# EAGLE board rc_filter_v1-xld50 (EAGLE 9.3.0), part 1 of 2
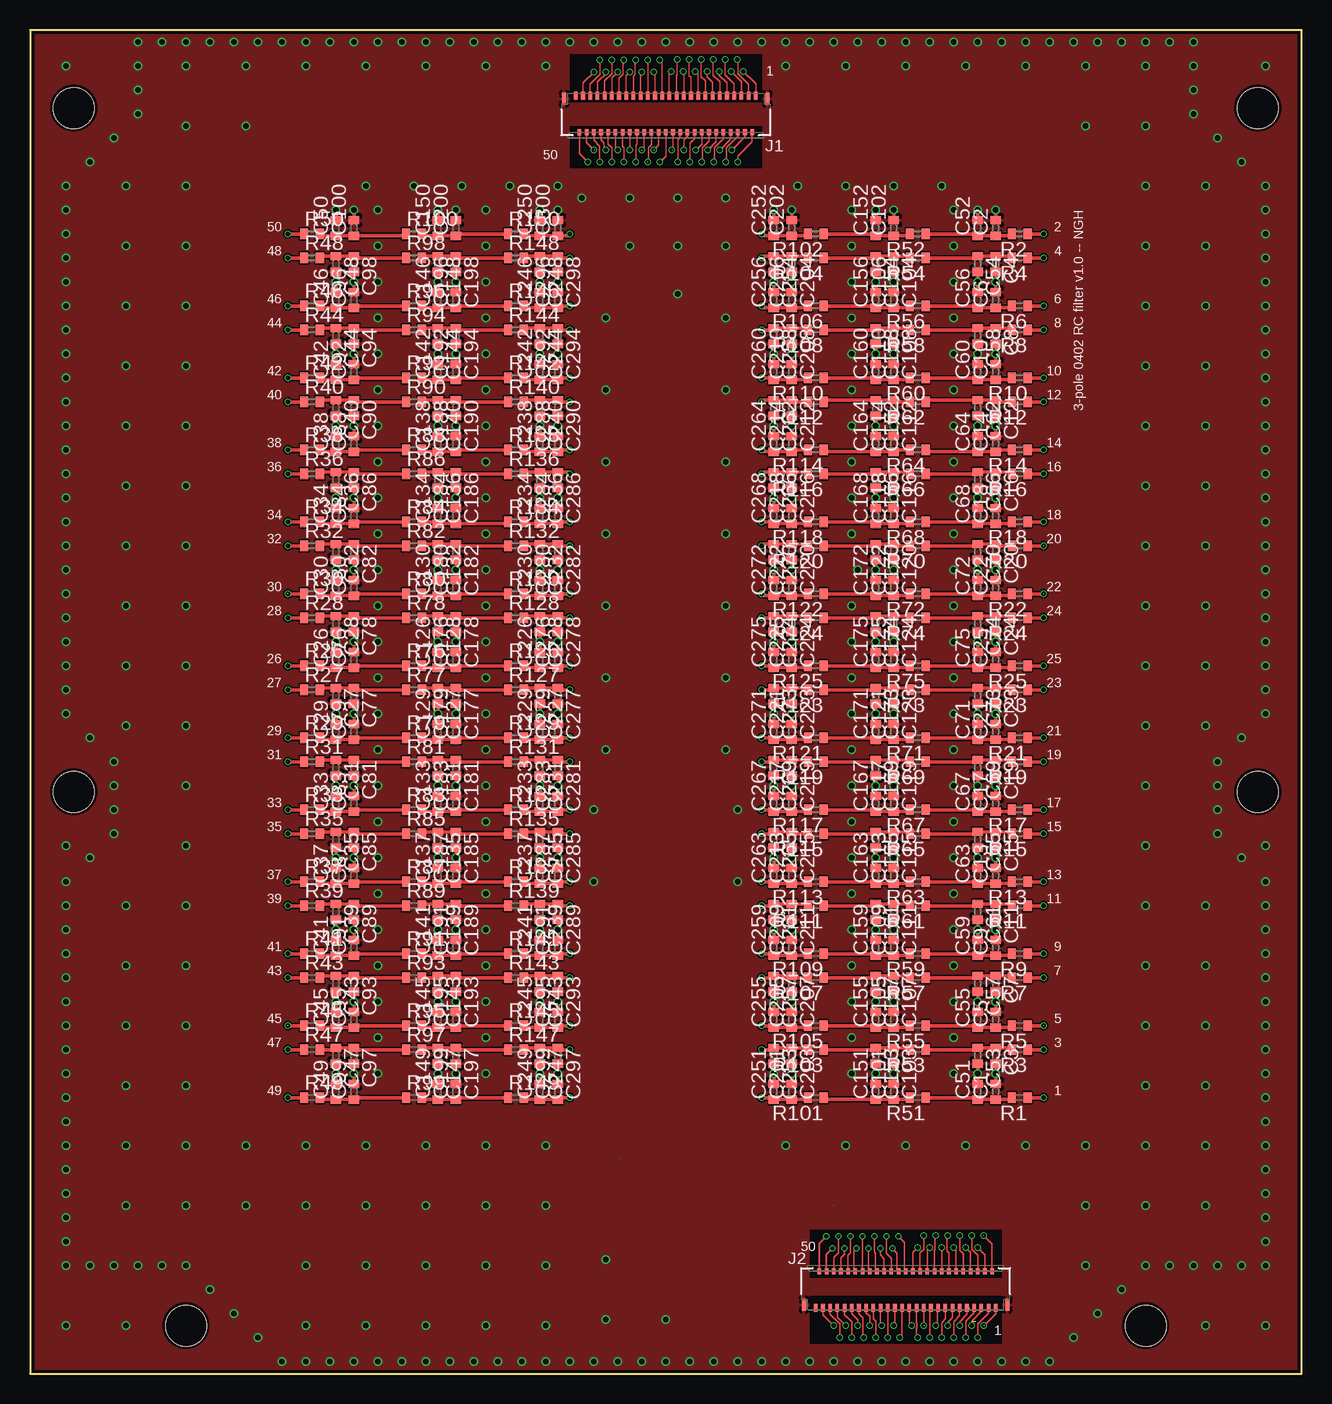
[diagram p3: board, top side]
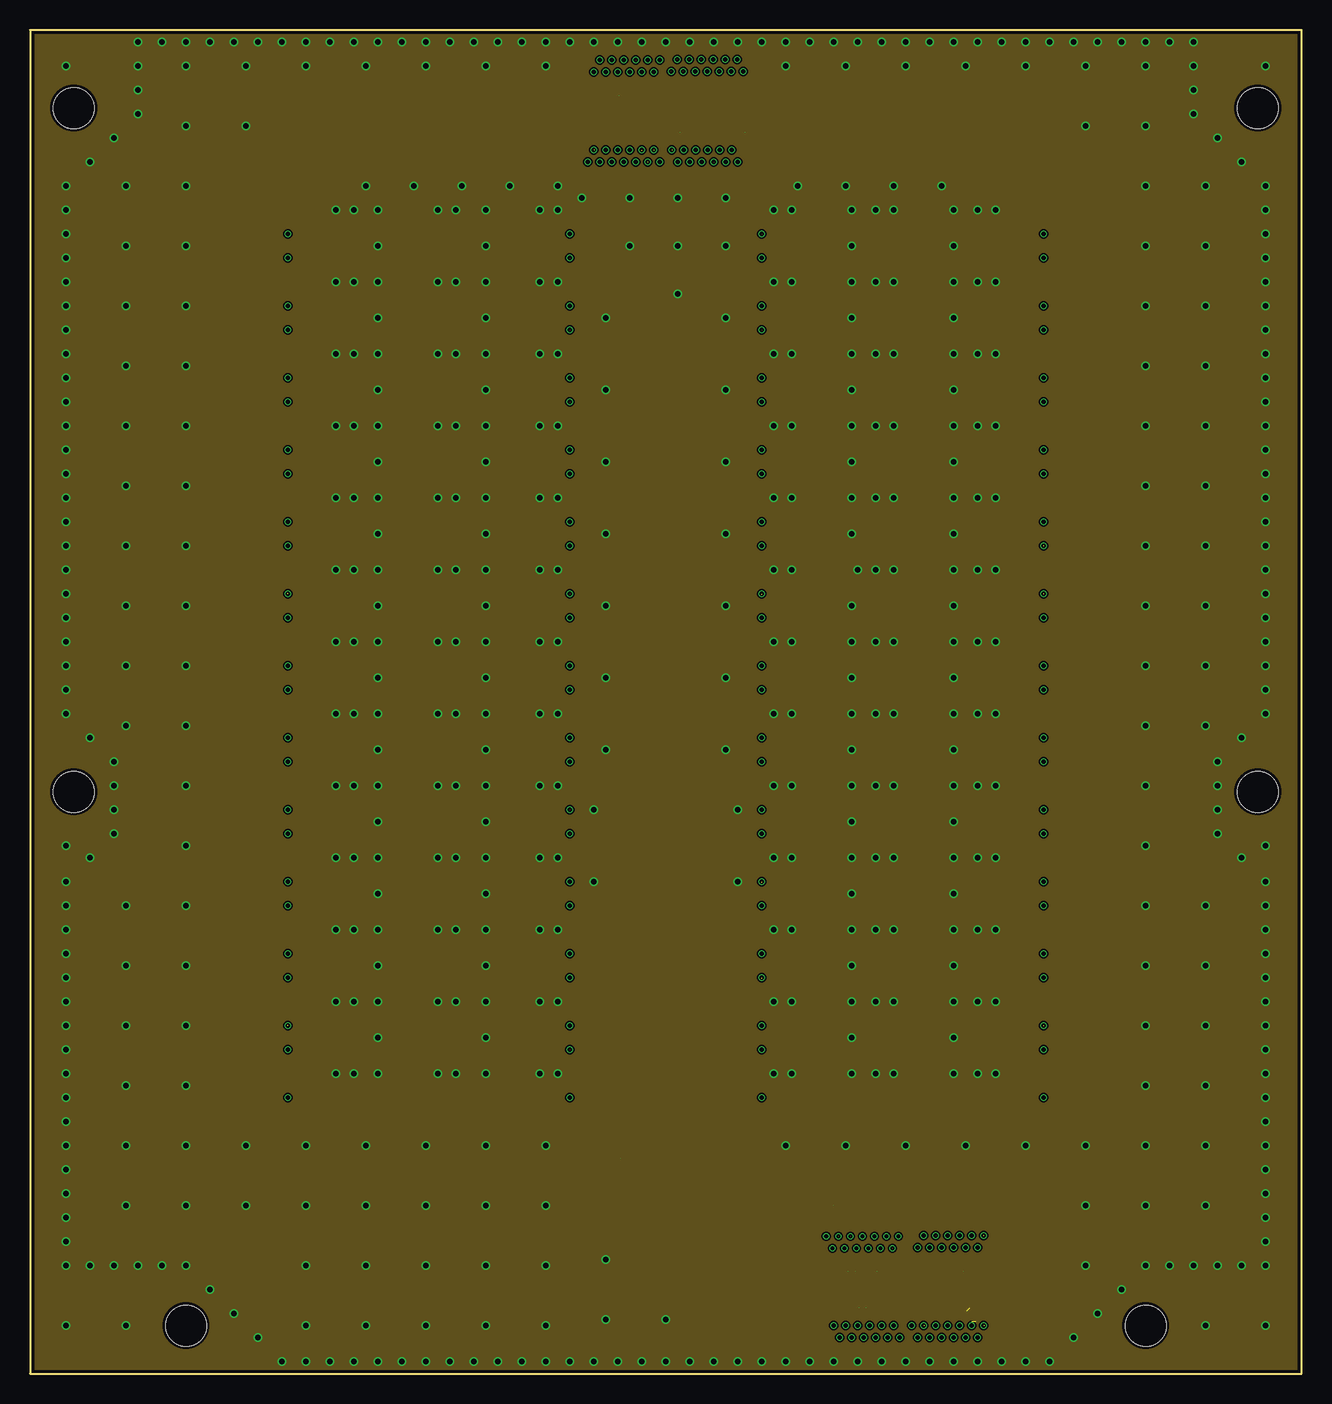
[diagram p4: board, inner layer Route2]
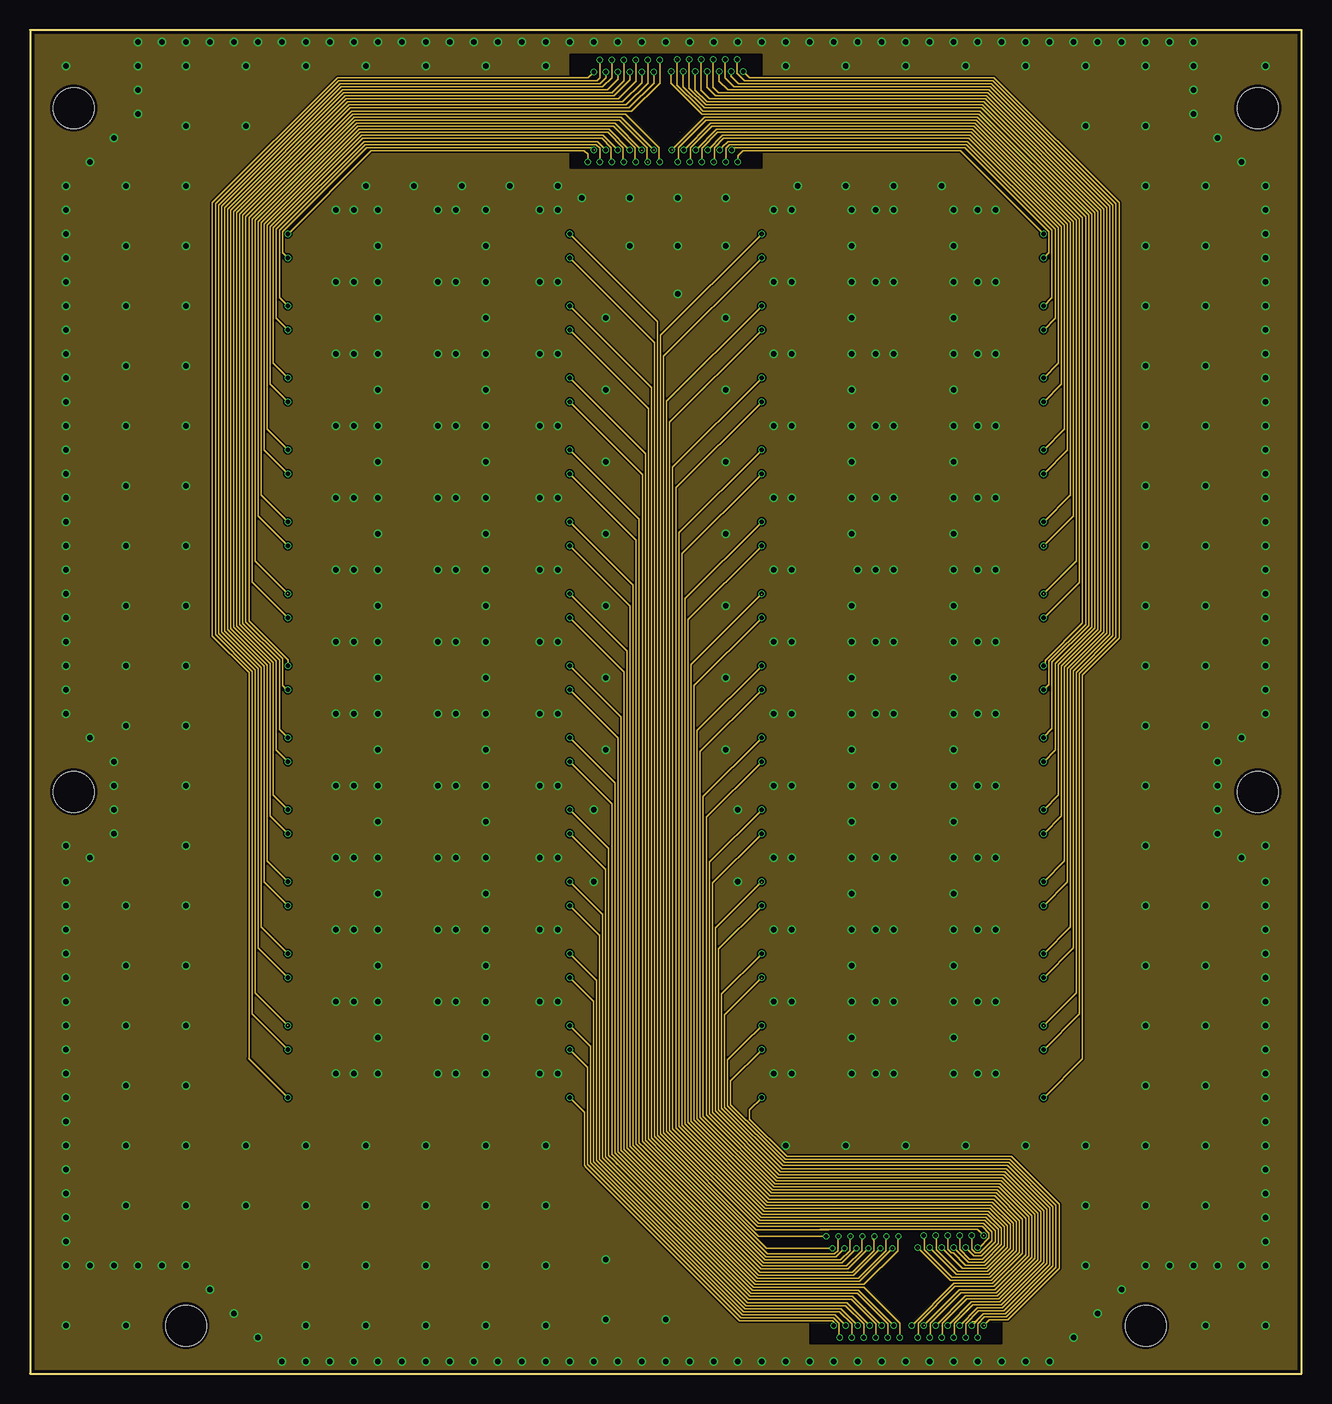
[diagram p5: board, inner layer Route15]
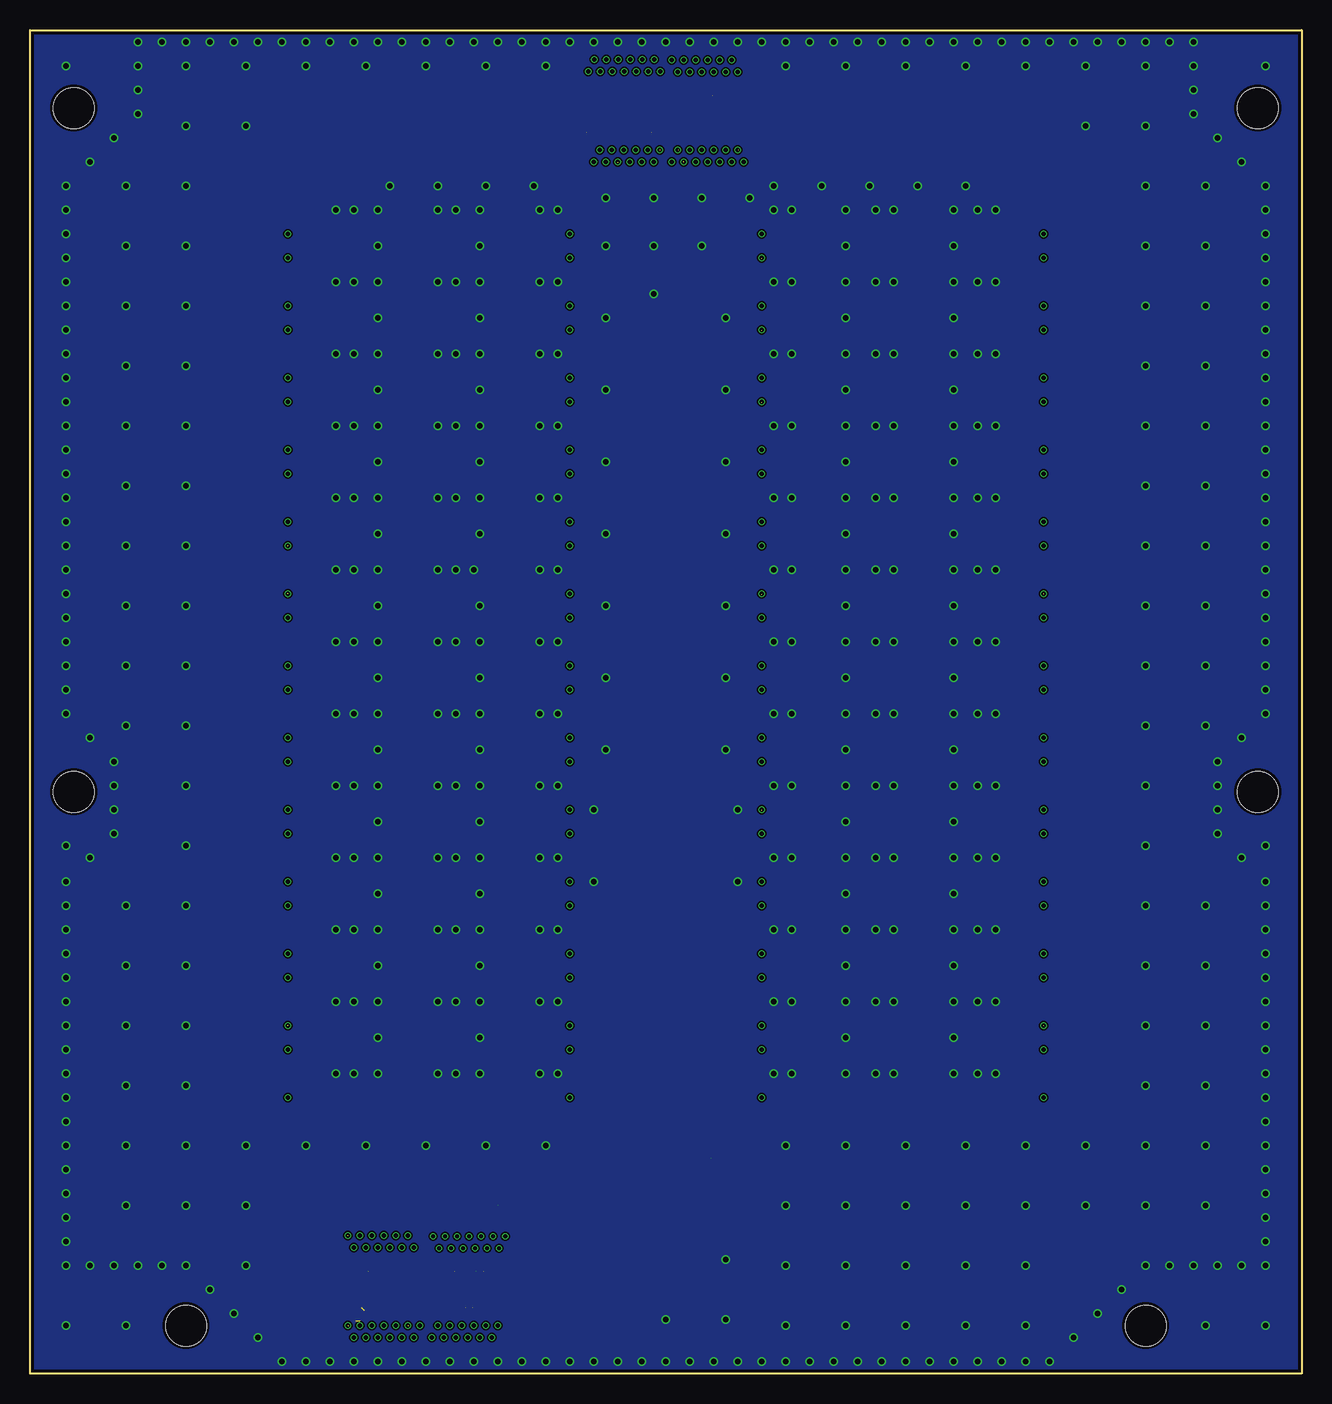
[diagram p6: board, bottom side, seen from below]

Size 106 x 112 mm. Coordinates in mm from the lower left corner, seen from the top.
Outline: 0,112 0,0 106,0 106,112 0,112
Copper layers ((1*2)+(15*16)): Top 0.048259375mm / dielectric 0.18288125mm / Route2 0.035559375mm / dielectric 39mil / Route15 0.035559375mm / dielectric 0.18288125mm / Bottom 0.048259375mm
Design rules "default *": minimum track width 5mil, minimum drill 0.2mm, track to track 5mil, track to pad 5mil, pad to pad 5mil, via to via 5mil, smd to smd 5mil, copper to edge 10mil, drill to drill 10mil, minimum pad ring 3mil, minimum via ring 3mil, stop-mask expansion 4mil, vias tented up to drill 16mil, thermal gap 10mil
Holes 3.4 mm at 93,4 13,4 3.65,48.5 3.65,105.5 102.35,105.5 102.35,48.5
tRestrict: area 65,2.5 to 81,6.5; area 45,106 to 61,110; area 45,100.5 to 61,104; area 65,8 to 81,12

## Footprints (pad centres in the part's own frame; a part is rotated, then mirrored left to right if it is on the bottom)
C0402 = smd 0.7 x 0.9: 1 -0.65,0; 2 0.65,0
MOLEX_502598-5193_0 = smd 0.3 x 0.67: 1 -7.5,-1.532; 3 -6.9,-1.532; 5 -6.3,-1.532; 7 -5.7,-1.532; 9 -5.1,-1.532; 11 -4.5,-1.532; 13 -3.9,-1.532; 15 -3.3,-1.532; 17 -2.7,-1.532; 19 -2.1,-1.532; 21 -1.5,-1.532; 23 -0.9,-1.532; 25 -0.3,-1.532; 27 0.3,-1.532; 29 0.9,-1.532; 31 1.5,-1.532; 33 2.1,-1.532; 35 2.7,-1.532; 37 3.3,-1.532; 39 3.9,-1.532; 41 4.5,-1.532; 43 5.1,-1.532; 45 5.7,-1.532; 47 6.3,-1.532; 49 6.9,-1.532; 51 7.5,-1.532 | smd 0.3 x 0.5: 2 -7.2,1.532; 4 -6.6,1.532; 6 -6,1.532; 8 -5.4,1.532; 10 -4.8,1.532; 12 -4.2,1.532; 14 -3.6,1.532; 16 -3,1.532; 18 -2.4,1.532; 20 -1.8,1.532; 22 -1.2,1.532; 24 -0.6,1.532; 26 0,1.532; 28 0.6,1.532; 30 1.2,1.532; 32 1.8,1.532; 34 2.4,1.532; 36 3,1.532; 38 3.6,1.532; 40 4.2,1.532; 42 4.8,1.532; 44 5.4,1.532; 46 6,1.532; 48 6.6,1.532; 50 7.2,1.532 | smd 0.35 x 1: MP1 -8.475,-1.267; MP2 8.475,-1.267
R0402 = smd 0.7 x 0.9: 1 -0.65,0; 2 0.65,0

## Placement (x,y rotation side)
C1  [C0402]  80.5,23.5 90 top
C2  [C0402]  80.5,95.5 90 top
C3  [C0402]  80.5,26.5 270 top
C4  [C0402]  80.5,92.5 270 top
C5  [C0402]  80.5,29.5 90 top
C6  [C0402]  80.5,89.5 90 top
C7  [C0402]  80.5,32.5 270 top
C8  [C0402]  80.5,86.5 270 top
C9  [C0402]  80.5,35.5 90 top
C10  [C0402]  80.5,83.5 90 top
C11  [C0402]  80.5,38.5 270 top
C12  [C0402]  80.5,80.5 270 top
C13  [C0402]  80.5,41.5 90 top
C14  [C0402]  80.5,77.5 90 top
C15  [C0402]  80.5,44.5 270 top
C16  [C0402]  80.5,74.5 270 top
C17  [C0402]  80.5,47.5 90 top
C18  [C0402]  80.5,71.5 90 top
C19  [C0402]  80.5,50.5 270 top
C20  [C0402]  80.5,68.5 270 top
C21  [C0402]  80.5,53.5 90 top
C22  [C0402]  80.5,65.5 90 top
C23  [C0402]  80.5,56.5 270 top
C24  [C0402]  80.5,62.5 270 top
C25  [C0402]  80.5,59.5 90 top
C26  [C0402]  25.5,59.5 90 top
C27  [C0402]  25.5,56.5 270 top
C28  [C0402]  25.5,62.5 270 top
C29  [C0402]  25.5,53.5 90 top
C30  [C0402]  25.5,65.5 90 top
C31  [C0402]  25.5,50.5 270 top
C32  [C0402]  25.5,68.5 270 top
C33  [C0402]  25.5,47.5 90 top
C34  [C0402]  25.5,71.5 90 top
C35  [C0402]  25.5,44.5 270 top
C36  [C0402]  25.5,74.5 270 top
C37  [C0402]  25.5,41.5 90 top
C38  [C0402]  25.5,77.5 90 top
C39  [C0402]  25.5,38.5 270 top
C40  [C0402]  25.5,80.5 270 top
C41  [C0402]  25.5,35.5 90 top
C42  [C0402]  25.5,83.5 90 top
C43  [C0402]  25.5,32.5 270 top
C44  [C0402]  25.5,86.5 270 top
C45  [C0402]  25.5,29.5 90 top
C46  [C0402]  25.5,89.5 90 top
C47  [C0402]  25.5,26.5 270 top
C48  [C0402]  25.5,92.5 270 top
C49  [C0402]  25.5,23.5 90 top
C50  [C0402]  25.5,95.5 90 top
C51  [C0402]  79,23.5 90 top
C52  [C0402]  79,95.5 90 top
C53  [C0402]  79,26.5 270 top
C54  [C0402]  79,92.5 270 top
C55  [C0402]  79,29.5 90 top
C56  [C0402]  79,89.5 90 top
C57  [C0402]  79,32.5 270 top
C58  [C0402]  79,86.5 270 top
C59  [C0402]  79,35.5 90 top
C60  [C0402]  79,83.5 90 top
C61  [C0402]  79,38.5 270 top
C62  [C0402]  79,80.5 270 top
C63  [C0402]  79,41.5 90 top
C64  [C0402]  79,77.5 90 top
C65  [C0402]  79,44.5 270 top
C66  [C0402]  79,74.5 270 top
C67  [C0402]  79,47.5 90 top
C68  [C0402]  79,71.5 90 top
C69  [C0402]  79,50.5 270 top
C70  [C0402]  79,68.5 270 top
C71  [C0402]  79,53.5 90 top
C72  [C0402]  79,65.5 90 top
C73  [C0402]  79,56.5 270 top
C74  [C0402]  79,62.5 270 top
C75  [C0402]  79,59.5 90 top
C76  [C0402]  27,59.5 90 top
C77  [C0402]  27,56.5 270 top
C78  [C0402]  27,62.5 270 top
C79  [C0402]  27,53.5 90 top
C80  [C0402]  27,65.5 90 top
C81  [C0402]  27,50.5 270 top
C82  [C0402]  27,68.5 270 top
C83  [C0402]  27,47.5 90 top
C84  [C0402]  27,71.5 90 top
C85  [C0402]  27,44.5 270 top
C86  [C0402]  27,74.5 270 top
C87  [C0402]  27,41.5 90 top
C88  [C0402]  27,77.5 90 top
C89  [C0402]  27,38.5 270 top
C90  [C0402]  27,80.5 270 top
C91  [C0402]  27,35.5 90 top
C92  [C0402]  27,83.5 90 top
C93  [C0402]  27,32.5 270 top
C94  [C0402]  27,86.5 270 top
C95  [C0402]  27,29.5 90 top
C96  [C0402]  27,89.5 90 top
C97  [C0402]  27,26.5 270 top
C98  [C0402]  27,92.5 270 top
C99  [C0402]  27,23.5 90 top
C100  [C0402]  27,95.5 90 top
C101  [C0402]  72,23.5 90 top
C102  [C0402]  72,95.5 90 top
C103  [C0402]  72,26.5 270 top
C104  [C0402]  72,92.5 270 top
C105  [C0402]  72,29.5 90 top
C106  [C0402]  72,89.5 90 top
C107  [C0402]  72,32.5 270 top
C108  [C0402]  72,86.5 270 top
C109  [C0402]  72,35.5 90 top
C110  [C0402]  72,83.5 90 top
C111  [C0402]  72,38.5 270 top
C112  [C0402]  72,80.5 270 top
C113  [C0402]  72,41.5 90 top
C114  [C0402]  72,77.5 90 top
C115  [C0402]  72,44.5 270 top
C116  [C0402]  72,74.5 270 top
C117  [C0402]  72,47.5 90 top
C118  [C0402]  72,71.5 90 top
C119  [C0402]  72,50.5 270 top
C120  [C0402]  72,68.5 270 top
C121  [C0402]  72,53.5 90 top
C122  [C0402]  72,65.5 90 top
C123  [C0402]  72,56.5 270 top
C124  [C0402]  72,62.5 270 top
C125  [C0402]  72,59.5 90 top
C126  [C0402]  34,59.5 90 top
C127  [C0402]  34,56.5 270 top
C128  [C0402]  34,62.5 270 top
C129  [C0402]  34,53.5 90 top
C130  [C0402]  34,65.5 90 top
C131  [C0402]  34,50.5 270 top
C132  [C0402]  34,68.5 270 top
C133  [C0402]  34,47.5 90 top
C134  [C0402]  34,71.5 90 top
C135  [C0402]  34,44.5 270 top
C136  [C0402]  34,74.5 270 top
C137  [C0402]  34,41.5 90 top
C138  [C0402]  34,77.5 90 top
C139  [C0402]  34,38.5 270 top
C140  [C0402]  34,80.5 270 top
C141  [C0402]  34,35.5 90 top
C142  [C0402]  34,83.5 90 top
C143  [C0402]  34,32.5 270 top
C144  [C0402]  34,86.5 270 top
C145  [C0402]  34,29.5 90 top
C146  [C0402]  34,89.5 90 top
C147  [C0402]  34,26.5 270 top
C148  [C0402]  34,92.5 270 top
C149  [C0402]  34,23.5 90 top
C150  [C0402]  34,95.5 90 top
C151  [C0402]  70.5,23.5 90 top
C152  [C0402]  70.5,95.5 90 top
C153  [C0402]  70.5,26.5 270 top
C154  [C0402]  70.5,92.5 270 top
C155  [C0402]  70.5,29.5 90 top
C156  [C0402]  70.5,89.5 90 top
C157  [C0402]  70.5,32.5 270 top
C158  [C0402]  70.5,86.5 270 top
C159  [C0402]  70.5,35.5 90 top
C160  [C0402]  70.5,83.5 90 top
C161  [C0402]  70.5,38.5 270 top
C162  [C0402]  70.5,80.5 270 top
C163  [C0402]  70.5,41.5 90 top
C164  [C0402]  70.5,77.5 90 top
C165  [C0402]  70.5,44.5 270 top
C166  [C0402]  70.5,74.5 270 top
C167  [C0402]  70.5,47.5 90 top
C168  [C0402]  70.5,71.5 90 top
C169  [C0402]  70.5,50.5 270 top
C170  [C0402]  70.5,68.5 270 top
C171  [C0402]  70.5,53.5 90 top
C172  [C0402]  70.5,65.5 90 top
C173  [C0402]  70.5,56.5 270 top
C174  [C0402]  70.5,62.5 270 top
C175  [C0402]  70.5,59.5 90 top
C176  [C0402]  35.5,59.5 90 top
C177  [C0402]  35.5,56.5 270 top
C178  [C0402]  35.5,62.5 270 top
C179  [C0402]  35.5,53.5 90 top
C180  [C0402]  35.5,65.5 90 top
C181  [C0402]  35.5,50.5 270 top
C182  [C0402]  35.5,68.5 270 top
C183  [C0402]  35.5,47.5 90 top
C184  [C0402]  35.5,71.5 90 top
C185  [C0402]  35.5,44.5 270 top
C186  [C0402]  35.5,74.5 270 top
C187  [C0402]  35.5,41.5 90 top
C188  [C0402]  35.5,77.5 90 top
C189  [C0402]  35.5,38.5 270 top
C190  [C0402]  35.5,80.5 270 top
C191  [C0402]  35.5,35.5 90 top
C192  [C0402]  35.5,83.5 90 top
C193  [C0402]  35.5,32.5 270 top
C194  [C0402]  35.5,86.5 270 top
C195  [C0402]  35.5,29.5 90 top
C196  [C0402]  35.5,89.5 90 top
C197  [C0402]  35.5,26.5 270 top
C198  [C0402]  35.5,92.5 270 top
C199  [C0402]  35.5,23.5 90 top
C200  [C0402]  35.5,95.5 90 top
C201  [C0402]  63.5,23.5 90 top
C202  [C0402]  63.5,95.5 90 top
C203  [C0402]  63.5,26.5 270 top
C204  [C0402]  63.5,92.5 270 top
C205  [C0402]  63.5,29.5 90 top
C206  [C0402]  63.5,89.5 90 top
C207  [C0402]  63.5,32.5 270 top
C208  [C0402]  63.5,86.5 270 top
C209  [C0402]  63.5,35.5 90 top
C210  [C0402]  63.5,83.5 90 top
C211  [C0402]  63.5,38.5 270 top
C212  [C0402]  63.5,80.5 270 top
C213  [C0402]  63.5,41.5 90 top
C214  [C0402]  63.5,77.5 90 top
C215  [C0402]  63.5,44.5 270 top
C216  [C0402]  63.5,74.5 270 top
C217  [C0402]  63.5,47.5 90 top
C218  [C0402]  63.5,71.5 90 top
C219  [C0402]  63.5,50.5 270 top
C220  [C0402]  63.5,68.5 270 top
C221  [C0402]  63.5,53.5 90 top
C222  [C0402]  63.5,65.5 90 top
C223  [C0402]  63.5,56.5 270 top
C224  [C0402]  63.5,62.5 270 top
C225  [C0402]  63.5,59.5 90 top
C226  [C0402]  42.5,59.5 90 top
C227  [C0402]  42.5,56.5 270 top
C228  [C0402]  42.5,62.5 270 top
C229  [C0402]  42.5,53.5 90 top
C230  [C0402]  42.5,65.5 90 top
C231  [C0402]  42.5,50.5 270 top
C232  [C0402]  42.5,68.5 270 top
C233  [C0402]  42.5,47.5 90 top
C234  [C0402]  42.5,71.5 90 top
C235  [C0402]  42.5,44.5 270 top
C236  [C0402]  42.5,74.5 270 top
C237  [C0402]  42.5,41.5 90 top
C238  [C0402]  42.5,77.5 90 top
C239  [C0402]  42.5,38.5 270 top
C240  [C0402]  42.5,80.5 270 top
C241  [C0402]  42.5,35.5 90 top
C242  [C0402]  42.5,83.5 90 top
C243  [C0402]  42.5,32.5 270 top
C244  [C0402]  42.5,86.5 270 top
C245  [C0402]  42.5,29.5 90 top
C246  [C0402]  42.5,89.5 90 top
C247  [C0402]  42.5,26.5 270 top
C248  [C0402]  42.5,92.5 270 top
C249  [C0402]  42.5,23.5 90 top
C250  [C0402]  42.5,95.5 90 top
C251  [C0402]  62,23.5 90 top
C252  [C0402]  62,95.5 90 top
C253  [C0402]  62,26.5 270 top
C254  [C0402]  62,92.5 270 top
C255  [C0402]  62,29.5 90 top
C256  [C0402]  62,89.5 90 top
C257  [C0402]  62,32.5 270 top
C258  [C0402]  62,86.5 270 top
C259  [C0402]  62,35.5 90 top
C260  [C0402]  62,83.5 90 top
C261  [C0402]  62,38.5 270 top
C262  [C0402]  62,80.5 270 top
C263  [C0402]  62,41.5 90 top
C264  [C0402]  62,77.5 90 top
C265  [C0402]  62,44.5 270 top
C266  [C0402]  62,74.5 270 top
C267  [C0402]  62,47.5 90 top
C268  [C0402]  62,71.5 90 top
C269  [C0402]  62,50.5 270 top
C270  [C0402]  62,68.5 270 top
C271  [C0402]  62,53.5 90 top
C272  [C0402]  62,65.5 90 top
C273  [C0402]  62,56.5 270 top
C274  [C0402]  62,62.5 270 top
C275  [C0402]  62,59.5 90 top
C276  [C0402]  44,59.5 90 top
C277  [C0402]  44,56.5 270 top
C278  [C0402]  44,62.5 270 top
C279  [C0402]  44,53.5 90 top
C280  [C0402]  44,65.5 90 top
C281  [C0402]  44,50.5 270 top
C282  [C0402]  44,68.5 270 top
C283  [C0402]  44,47.5 90 top
C284  [C0402]  44,71.5 90 top
C285  [C0402]  44,44.5 270 top
C286  [C0402]  44,74.5 270 top
C287  [C0402]  44,41.5 90 top
C288  [C0402]  44,77.5 90 top
C289  [C0402]  44,38.5 270 top
C290  [C0402]  44,80.5 270 top
C291  [C0402]  44,35.5 90 top
C292  [C0402]  44,83.5 90 top
C293  [C0402]  44,32.5 270 top
C294  [C0402]  44,86.5 270 top
C295  [C0402]  44,29.5 90 top
C296  [C0402]  44,89.5 90 top
C297  [C0402]  44,26.5 270 top
C298  [C0402]  44,92.5 270 top
C299  [C0402]  44,23.5 90 top
C300  [C0402]  44,95.5 90 top
J1  MOLEX_502598-5193MOLEX_502598-5193_0_0  [MOLEX_502598-5193_0]  53,105 180 top
J2  MOLEX_502598-5193MOLEX_502598-5193_0_0  [MOLEX_502598-5193_0]  73,7 0 top
R1  [R0402]  82.5,23 180 top
R2  [R0402]  82.5,95 180 top
R3  [R0402]  82.5,27 180 top
R4  [R0402]  82.5,93 180 top
R5  [R0402]  82.5,29 180 top
R6  [R0402]  82.5,89 180 top
R7  [R0402]  82.5,33 180 top
R8  [R0402]  82.5,87 180 top
R9  [R0402]  82.5,35 180 top
R10  [R0402]  82.5,83 180 top
R11  [R0402]  82.5,39 180 top
R12  [R0402]  82.5,81 180 top
R13  [R0402]  82.5,41 180 top
R14  [R0402]  82.5,77 180 top
R15  [R0402]  82.5,45 180 top
R16  [R0402]  82.5,75 180 top
R17  [R0402]  82.5,47 180 top
R18  [R0402]  82.5,71 180 top
R19  [R0402]  82.5,51 180 top
R20  [R0402]  82.5,69 180 top
R21  [R0402]  82.5,53 180 top
R22  [R0402]  82.5,65 180 top
R23  [R0402]  82.5,57 180 top
R24  [R0402]  82.5,63 180 top
R25  [R0402]  82.5,59 180 top
R26  [R0402]  23.5,59 0 top
R27  [R0402]  23.5,57 0 top
R28  [R0402]  23.5,63 0 top
R29  [R0402]  23.5,53 0 top
R30  [R0402]  23.5,65 0 top
R31  [R0402]  23.5,51 0 top
R32  [R0402]  23.5,69 0 top
R33  [R0402]  23.5,47 0 top
R34  [R0402]  23.5,71 0 top
R35  [R0402]  23.5,45 0 top
R36  [R0402]  23.5,75 0 top
R37  [R0402]  23.5,41 0 top
R38  [R0402]  23.5,77 0 top
R39  [R0402]  23.5,39 0 top
R40  [R0402]  23.5,81 0 top
R41  [R0402]  23.5,35 0 top
R42  [R0402]  23.5,83 0 top
R43  [R0402]  23.5,33 0 top
R44  [R0402]  23.5,87 0 top
R45  [R0402]  23.5,29 0 top
R46  [R0402]  23.5,89 0 top
R47  [R0402]  23.5,27 0 top
R48  [R0402]  23.5,93 0 top
R49  [R0402]  23.5,23 0 top
R50  [R0402]  23.5,95 0 top
R51  [R0402]  74,23 180 top
R52  [R0402]  74,95 180 top
R53  [R0402]  74,27 180 top
R54  [R0402]  74,93 180 top
R55  [R0402]  74,29 180 top
R56  [R0402]  74,89 180 top
R57  [R0402]  74,33 180 top
R58  [R0402]  74,87 180 top
R59  [R0402]  74,35 180 top
R60  [R0402]  74,83 180 top
R61  [R0402]  74,39 180 top
R62  [R0402]  74,81 180 top
R63  [R0402]  74,41 180 top
R64  [R0402]  74,77 180 top
R65  [R0402]  74,45 180 top
R66  [R0402]  74,75 180 top
R67  [R0402]  74,47 180 top
R68  [R0402]  74,71 180 top
R69  [R0402]  74,51 180 top
R70  [R0402]  74,69 180 top
R71  [R0402]  74,53 180 top
R72  [R0402]  74,65 180 top
R73  [R0402]  74,57 180 top
R74  [R0402]  74,63 180 top
R75  [R0402]  74,59 180 top
R76  [R0402]  32,59 0 top
R77  [R0402]  32,57 0 top
R78  [R0402]  32,63 0 top
R79  [R0402]  32,53 0 top
R80  [R0402]  32,65 0 top
R81  [R0402]  32,51 0 top
R82  [R0402]  32,69 0 top
R83  [R0402]  32,47 0 top
R84  [R0402]  32,71 0 top
R85  [R0402]  32,45 0 top
R86  [R0402]  32,75 0 top
R87  [R0402]  32,41 0 top
R88  [R0402]  32,77 0 top
R89  [R0402]  32,39 0 top
R90  [R0402]  32,81 0 top
R91  [R0402]  32,35 0 top
R92  [R0402]  32,83 0 top
R93  [R0402]  32,33 0 top
R94  [R0402]  32,87 0 top
R95  [R0402]  32,29 0 top
R96  [R0402]  32,89 0 top
R97  [R0402]  32,27 0 top
R98  [R0402]  32,93 0 top
R99  [R0402]  32,23 0 top
R100  [R0402]  32,95 0 top
R101  [R0402]  65.5,23 180 top
R102  [R0402]  65.5,95 180 top
R103  [R0402]  65.5,27 180 top
R104  [R0402]  65.5,93 180 top
R105  [R0402]  65.5,29 180 top
R106  [R0402]  65.5,89 180 top
R107  [R0402]  65.5,33 180 top
R108  [R0402]  65.5,87 180 top
R109  [R0402]  65.5,35 180 top
R110  [R0402]  65.5,83 180 top
R111  [R0402]  65.5,39 180 top
R112  [R0402]  65.5,81 180 top
R113  [R0402]  65.5,41 180 top
R114  [R0402]  65.5,77 180 top
R115  [R0402]  65.5,45 180 top
R116  [R0402]  65.5,75 180 top
R117  [R0402]  65.5,47 180 top
R118  [R0402]  65.5,71 180 top
R119  [R0402]  65.5,51 180 top
R120  [R0402]  65.5,69 180 top
R121  [R0402]  65.5,53 180 top
R122  [R0402]  65.5,65 180 top
R123  [R0402]  65.5,57 180 top
R124  [R0402]  65.5,63 180 top
R125  [R0402]  65.5,59 180 top
R126  [R0402]  40.5,59 0 top
R127  [R0402]  40.5,57 0 top
R128  [R0402]  40.5,63 0 top
R129  [R0402]  40.5,53 0 top
R130  [R0402]  40.5,65 0 top
R131  [R0402]  40.5,51 0 top
R132  [R0402]  40.5,69 0 top
R133  [R0402]  40.5,47 0 top
R134  [R0402]  40.5,71 0 top
R135  [R0402]  40.5,45 0 top
R136  [R0402]  40.5,75 0 top
R137  [R0402]  40.5,41 0 top
R138  [R0402]  40.5,77 0 top
R139  [R0402]  40.5,39 0 top
R140  [R0402]  40.5,81 0 top
R141  [R0402]  40.5,35 0 top
R142  [R0402]  40.5,83 0 top
R143  [R0402]  40.5,33 0 top
R144  [R0402]  40.5,87 0 top
R145  [R0402]  40.5,29 0 top
R146  [R0402]  40.5,89 0 top
R147  [R0402]  40.5,27 0 top
R148  [R0402]  40.5,93 0 top
R149  [R0402]  40.5,23 0 top
R150  [R0402]  40.5,95 0 top